# EAGLE design ble112_breakout_board_v22 (EAGLE 7.7.0)
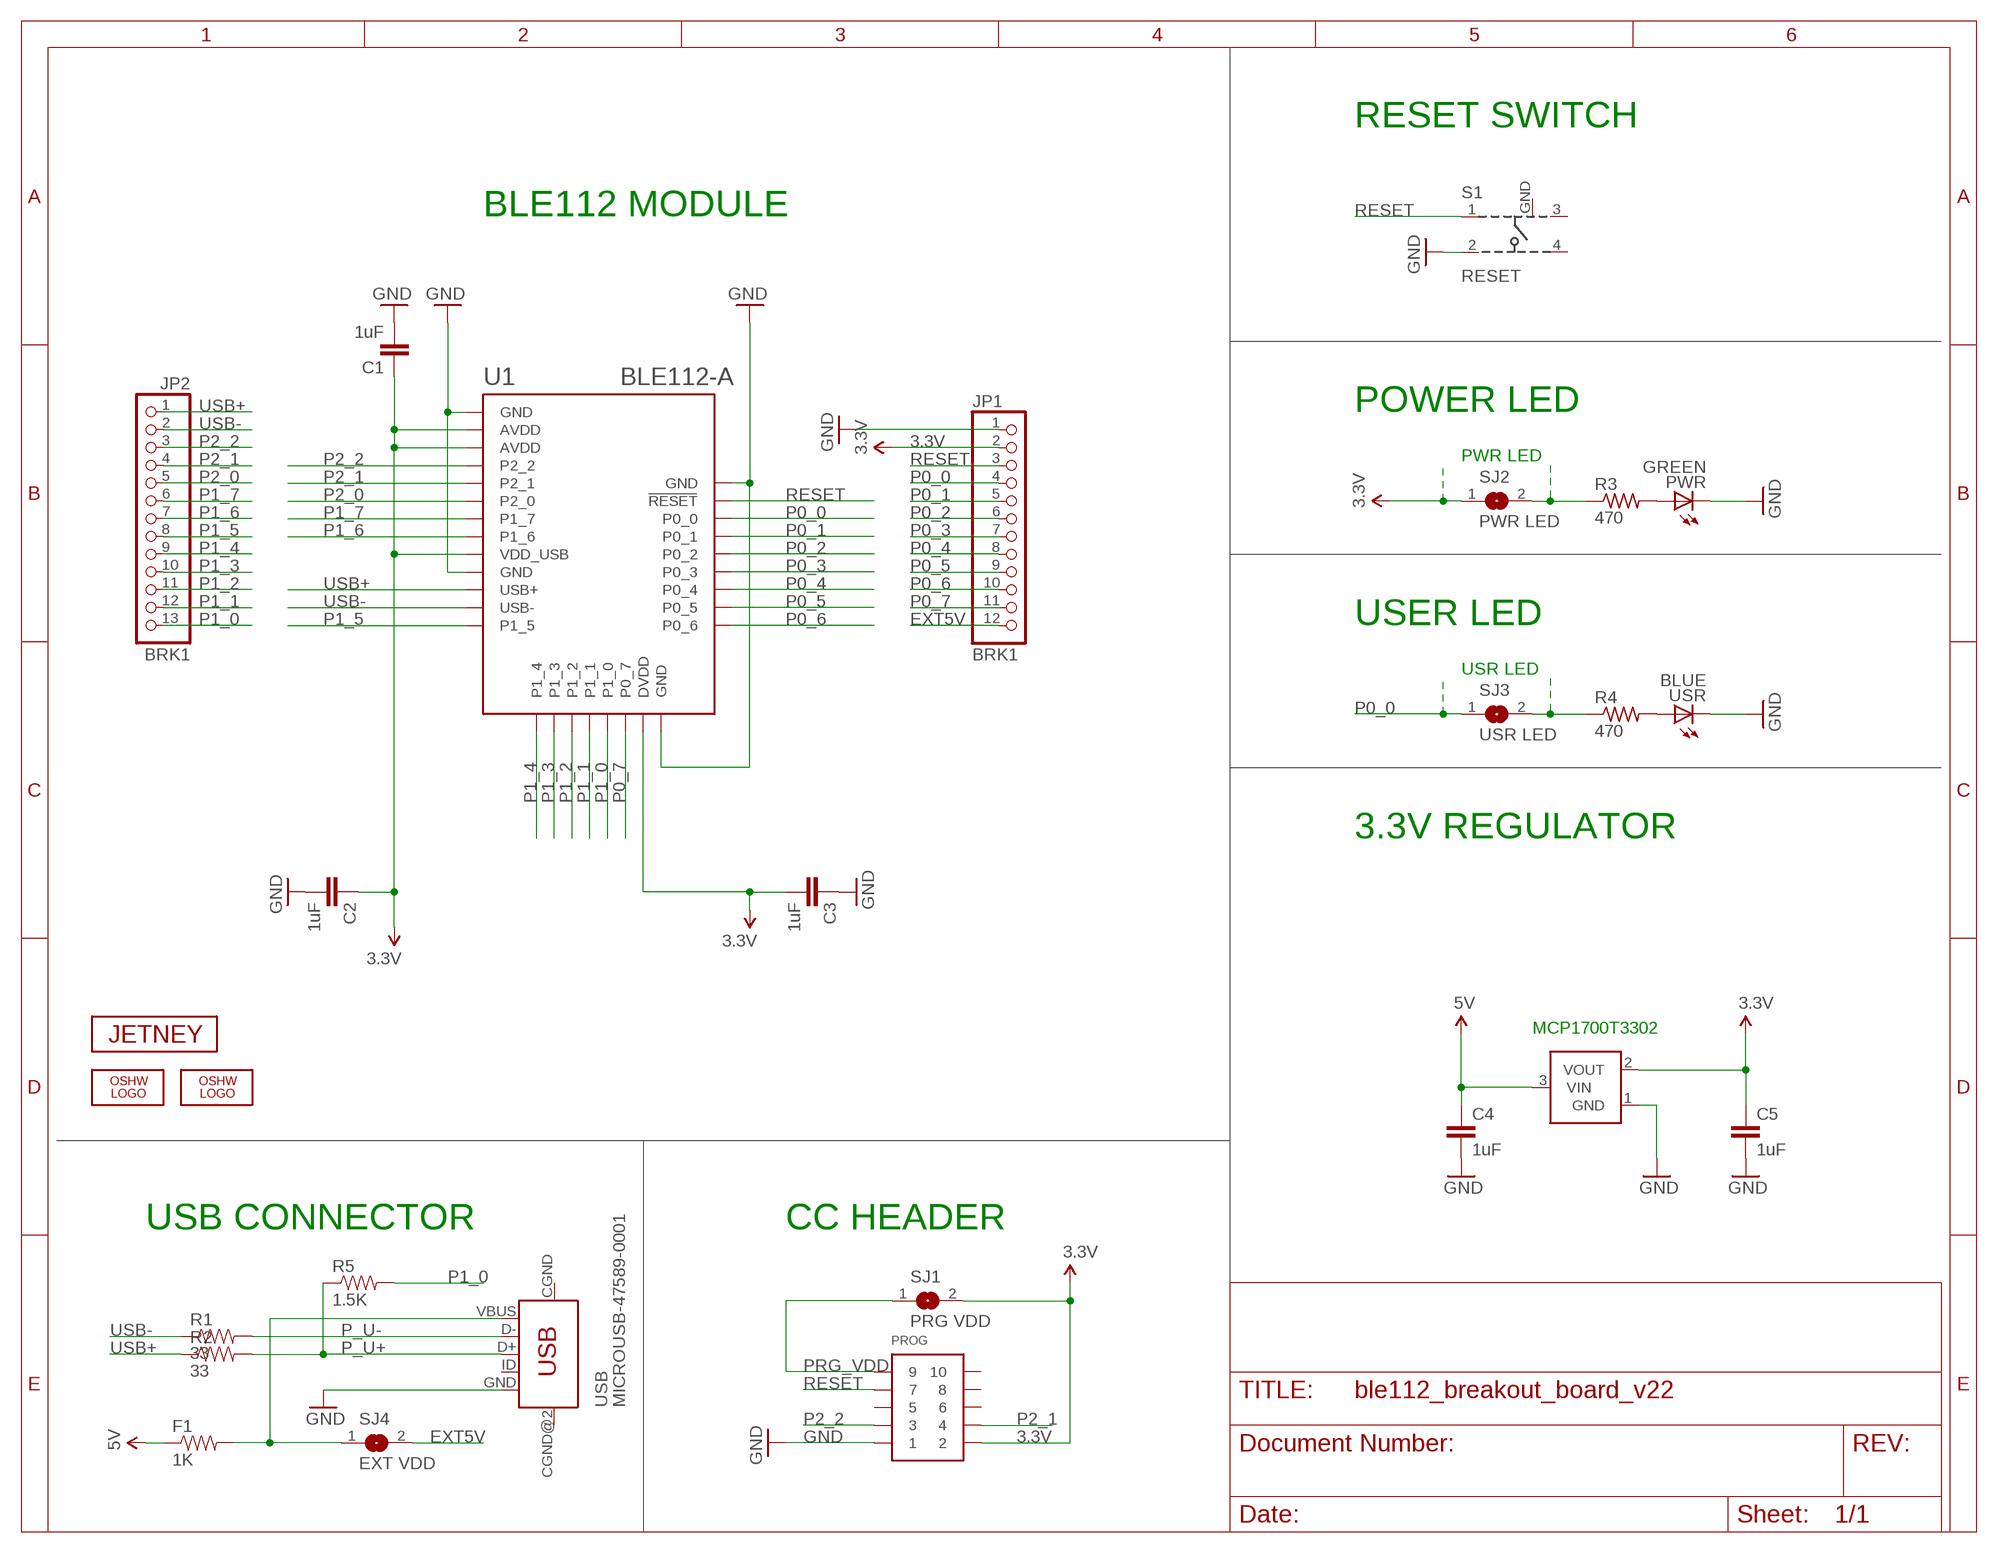
[diagram p0: schematic, sheet 1]

## Parts
C1  1uF  CAP0603-CAP  [0603-CAP]
C2  1uF  CAP0603-CAP  [0603-CAP]
C3  1uF  CAP0603-CAP  [0603-CAP]
C4  1uF  CAP0603-CAP  [0603-CAP]
C5  1uF  CAP0603-CAP  [0603-CAP]
F1  1K  RESISTOR0805-RES  [0805]
JP1  BRK1  PINHD-1X12  [1X12]
JP2  BRK1  PINHD-1X13  [1X13]
LOGO1  OSHW_LOGO_FILLX0100-NT  [OSHW_FILLX100_NOTEXT]
LOGO2  OSHW_LOGO_FILLX0100-NT  [OSHW_FILLX100_NOTEXT]
PROG  CONN_5-2-FTSH-V  [FTSH-105-DV]
PWR  GREEN  LEDCHIPLED_0805  [CHIPLED_0805]
R1  33  RESISTOR0603-RES  [0603-RES]
R2  33  RESISTOR0603-RES  [0603-RES]
R3  470  R-US_R0603  [R0603]
R4  470  R-US_R0603  [R0603]
R5  1.5K  RESISTOR0603-RES  [0603-RES]
S1  RESET  101-IG  [101-IG]
SJ1  PRG VDD  SJ  [SJ]
SJ2  PWR LED  SJ  [SJ]
SJ3  USR LED  SJ  [SJ]
SJ4  EXT VDD  SJ  [SJ]
U1  BLE112-A  BLE112-VISUAL-A  [BLE112-A]
U2  MCP1700  [SOT23-3]
U$3  JETNEY-LOGO-12  [JETNEY-LOGO-12]
USB  MICROUSB-47589-0001  [MICROUSB-47589-0001]
USR  BLUE  LEDCHIPLED_0805  [CHIPLED_0805]

## Nets
3.3V [power]: C1.1 C2.1 C3.2 C5.1 JP1.2 PROG.2 SJ1.2 SJ2.1 U1.AVDD U1.AVDD@2(AVDD) U1.DVDD U1.VDD_USB U2.2(VOUT)
5V [power]: C4.1 F1.1 U2.3(VIN)
EXT5V [power]: JP1.12 SJ4.2
GND [power]: C1.2 C2.2 C3.1 C4.2 C5.2 JP1.1 PROG.1 PWR.C S1.2 U1.GND U1.GND@2(GND) U1.GND@3(GND) U1.GND@4(GND) U2.1(GND) USB.GND USR.C
N$1: PWR.A R3.2
N$3 [power]: R3.1 SJ2.2
N$4: R4.2 USR.A
N$5: R4.1 SJ3.2
P0_0: JP1.4 SJ3.1 U1.P0_0
P0_1: JP1.5 U1.P0_1
P0_2: JP1.6 U1.P0_2
P0_3: JP1.7 U1.P0_3
P0_4: JP1.8 U1.P0_4
P0_5: JP1.9 U1.P0_5
P0_6: JP1.10 U1.P0_6
P0_7: JP1.11 U1.P0_7
P1_0: JP2.13 R5.2 U1.P1_0
P1_1: JP2.12 U1.P1_1
P1_2: JP2.11 U1.P1_2
P1_3: JP2.10 U1.P1_3
P1_4: JP2.9 U1.P1_4
P1_5: JP2.8 U1.P1_5
P1_6: JP2.7 U1.P1_6
P1_7: JP2.6 U1.P1_7
P2_0: JP2.5 U1.P2_0
P2_1: JP2.4 PROG.4 U1.P2_1
P2_2: JP2.3 PROG.3 U1.P2_2
P_U+: R2.2 R5.1 USB.D+
P_U-: R1.2 USB.D-
PRG_VDD [power]: PROG.9 SJ1.1
RESET: JP1.3 PROG.7 S1.1 U1.RESET
USB+: JP2.1 R2.1 U1.USB+
USB-: JP2.2 R1.1 U1.USB-
VBUS [power]: F1.2 SJ4.1 USB.VBUS
Unconnected: PROG.5 PROG.6 PROG.8 PROG.10 S1.3 S1.4 USB.CGND(MTN2) USB.CGND@2(MTN4) USB.ID

## Notes on the sheet
- RESET SWITCH
- BLE112 MODULE
- POWER LED
- PWR LED
- USER LED
- USR LED
- 3.3V REGULATOR
- MCP1700T3302
- USB CONNECTOR | CC HEADER

## Power pins joined to a net without a drawn wire
GND: S1.GND

## Library data of the parts
C1-C5 = SparkFun:CAP: Capacitor Standard 0603 ceramic capacitor, and 0.1" leaded capacitor.
F1 R1 R2 R5 = SparkFun:RESISTOR: Resistor Basic schematic elements and footprints for 0603, 1206, and PTH resistors.
JP1 = sf-pinhead:PINHD-1X12: PIN HEADER
JP2 = sf-pinhead:PINHD-1X13: PIN HEADER
LOGO1 LOGO2 = oshw-logo:OSHW_LOGO_FILL
PROG = pel_misc:CONN_5-2
PWR USR = led:LED: LED OSRAM: - CHIPLED LG R971, LG N971, LY N971, LG Q971, LY Q971, LO R971, LY R971 LH N974, LH R974 LS Q976, LO Q976, LY Q976 LO Q996 - Hyper CHIPLED LW Q18S LB Q993, LB Q99A, LB R99A - SideLED LS A670, LO A670, LY A670, LG A670, LP A670 LB A673, LV A673, LT A673, LW A673 LH A674 LY A675 LS A676, LA A676, LO A676, LY A676, LW A676 LS A679, LY A679, LG A679 - Hyper Micro SIDELED® LS Y876, LA Y876, LO Y876, LY Y876 LT Y87S - SmartLED LW L88C, LW L88S LB L89C, LB L89S, LG L890 LS L89K, LO L89K, LY L89K LS L896, LA L896, LO L896, LY L896 - TOPLED LS T670, LO T670, LY T670, LG T670, LP T670 LSG T670, LSP T670, LSY T670, LOP T670, LYG T670 LG T671, LOG T671, LSG T671 LB T673, LV T673, LT T673, LW T673 LH T674 LS T676, LA T676, LO T676, LY T676, LB T676, LH T676, LSB T676, LW T676 LB T67C, LV T67C, LT T67C, LS T67K, LO T67K, LY T67K, LW E67C LS E67B, LA E67B, LO E67B, LY E67B, LB E67C, LV E67C, LT E67C LW T67C LS T679, LY T679, LG T679 LS T770, LO T770, LY T770, LG T770, LP T770 LB T773, LV T773, LT T773, LW T773 LH T774 LS E675, LA E675, LY E675, LS T675 LS T776, LA T776, LO T776, LY T776, LB T776 LHGB T686 LT T68C, LB T68C - Hyper Mini TOPLED® LB M676 - Mini TOPLED Santana® LG M470 LS M47K, LO M47K, LY M47K Source: http://www.osram.convergy.de LUXEON: - LUMILED® LXK2-PW12-R00, LXK2-PW12-S00, LXK2-PW14-U00, LXK2-PW14-V00 LXK2-PM12-R00, LXK2-PM12-S00, LXK2-PM14-U00 LXK2-PE12-Q00, LXK2-PE12-R00, LXK2-PE12-S00, LXK2-PE14-T00, LXK2-PE14-U00 LXK2-PB12-K00, LXK2-PB12-L00, LXK2-PB12-M00, LXK2-PB14-N00, LXK2-PB14-P00, LXK2-PB14-Q00 LXK2-PR12-L00, LXK2-PR12-M00, LXK2-PR14-Q00, LXK2-PR14-R00 LXK2-PD12-Q00, LXK2-PD12-R00, LXK2-PD12-S00 LXK2-PH12-R00, LXK2-PH12-S00 LXK2-PL12-P00, LXK2-PL12-Q00, LXK2-PL12-R00 Source: www.luxeon.com KINGBRIGHT: KA-3528ASYC Source: www.kingbright.com
R3 R4 = resistor:R-US_: RESISTOR, American symbol
S1 = sf-keyglove:101-IG
SJ1-SJ4 = jumper:SJ: SMD solder JUMPER
U1 = sf-bluegiga:BLE112-VISUAL: Bluetooth Low Energy single-mode module - Bluetooth 4.0 (CC2540). BLE112-A variant has an on-module ceramic chip antenna, BLE112-E variant has U.Fl connector. BLE112-A variant includes keepout/restrict area. Antenna edge of the module should be flush up against the edge of the PCB. See datasheet for variant layout details. The BLE112 is a Bluetooth Smart module targeted for low-power sensors and accessories. It integrates all features required for a Bluetooth Smart application, including Bluetooth radio, software stack, and GATT-based profiles. The BLE112 Bluetooth Smart module can also host end-user applications, which means no external micro controller is required in size or price constrained devices. Morover, ithas flexible hardware interfaces to connect to different peripherals and sensors and can be powered directly from a standard 3V coin cell battery or a pair of AAA batteries. In the lowest power sleep mode it merely consumes 500 nA and will wake up within a few hundred microseconds. http://www.bluegiga.com/en-US/products/bluetooth-4.0-modules/ble112-bluetooth--smart-module https://github.com/jrowberg/sf-oshw Last updated 2014-01-04 by Jeff Rowberg <jeff@rowberg.net>; ANTENNA: On-module ceramic chip antenna
U2 = nonolith:MCP1700: Voltage regulator
U$3 = sf-keyglove:JETNEY-LOGO
USB = sf-keyglove:MICROUSB-47589-0001

## Net classes
0 default: width 0.152 mm, drill 0.33 mm, clearance 0.152 mm
1 power: width 0.254 mm, drill 0.33 mm, clearance 0.152 mm

## Board
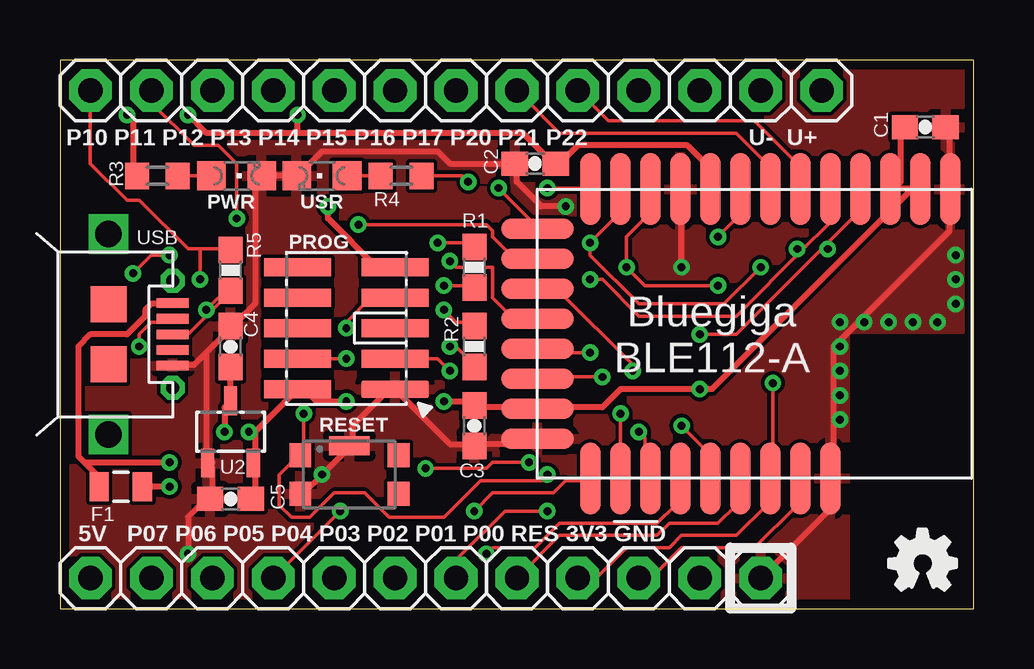
[diagram p1: board, top side]
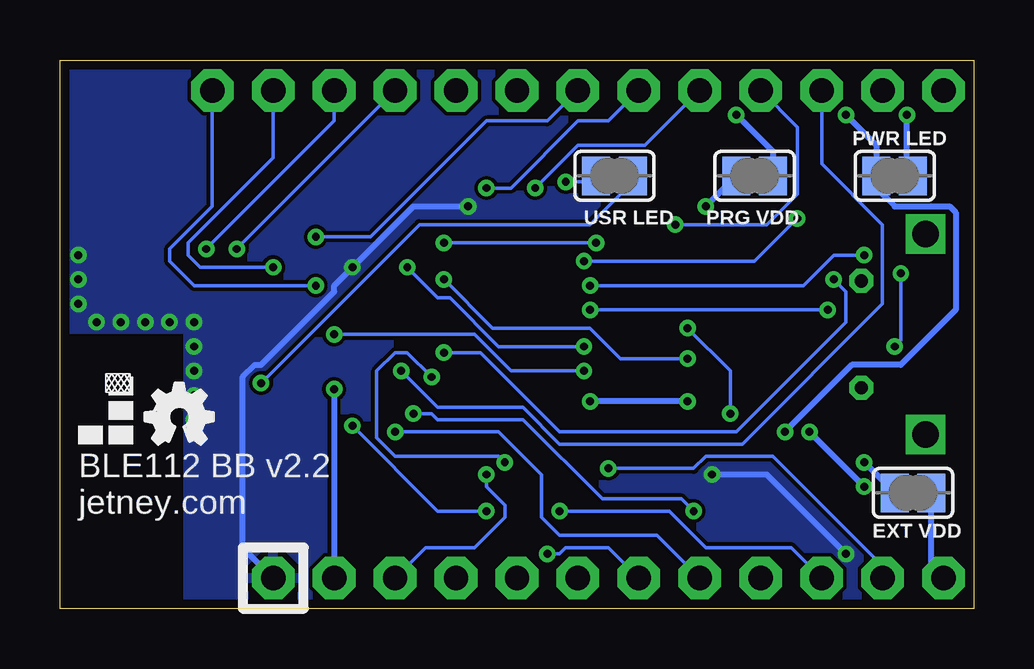
[diagram p2: board, bottom side, seen from below]

Size 38.1 x 22.86 mm. Coordinates in mm from the lower left corner, seen from the top.
Outline: 0,0 38.1,0 38.1,22.86 0,22.86 0,0
Copper layers (1*16): Top 0.0356mm / dielectric 1.5011mm / Bottom 0.0356mm
Design rules "default": minimum track width 6mil, minimum drill 13mil, track to track 6mil, track to pad 6mil, pad to pad 6mil, via to via 6mil, smd to smd 6mil, copper to edge 15mil, drill to drill 6mil, minimum pad ring 7mil, minimum via ring 7mil, stop-mask expansion 4mil, vias tented up to drill 13mil, thermal gap 10mil
tKeepout: area 33,0 to 38,5.6
bKeepout: area 33,0 to 38,5.6
tRestrict: area 33,0 to 38,5.6
bRestrict: area 33,0 to 38,5.6
vRestrict: area 0.3,19.3 to 32.8,20.1; area 0.5,2.8 to 30.5,3.6; area 33,0 to 38,5.6

### Footprints (pad centres in the part's own frame; a part is rotated, then mirrored left to right if it is on the bottom)
0603-CAP = smd 1.1 x 1: 1 -0.85,0; 2 0.85,0
0805 = smd 0.8 x 1.2: 1 -0.9,0; 2 0.9,0
1X12 = drill 1.016 pad 1.778 octagon: 1 -13.97,0; 2 -11.43,0; 3 -8.89,0; 4 -6.35,0; 5 -3.81,0; 6 -1.27,0; 7 1.27,0; 8 3.81,0; 9 6.35,0; 10 8.89,0; 11 11.43,0; 12 13.97,0
1X13 = drill 1.016 pad 1.778 octagon: 1 -15.24,0; 2 -12.7,0; 3 -10.16,0; 4 -7.62,0; 5 -5.08,0; 6 -2.54,0; 7 0,0; 8 2.54,0; 9 5.08,0; 10 7.62,0; 11 10.16,0; 12 12.7,0; 13 15.24,0
FTSH-105-DV = smd 0.74 x 2.8: 1 -2.54,-2.03; 2 -2.54,2.03; 3 -1.27,-2.03; 4 -1.27,2.03; 5 0,-2.03; 6 0,2.03; 7 1.27,-2.03; 8 1.27,2.03; 9 2.54,-2.03; 10 2.54,2.03
CHIPLED_0805 = smd 1.2 x 1.2: A 0,-1.05; C 0,1.05
0603-RES = smd 1.1 x 1: 1 -0.85,0; 2 0.85,0
R0603 = smd 1 x 1.1: 1 -0.85,0; 2 0.85,0
101-IG = smd 0.9 x 1: 1 -2.05,0.8; 2 -2.05,-0.8; 3 2.05,0.8; 4 2.05,-0.8 | smd 1.7 x 0.8: GND 0,1.2
SJ = smd 1.168 x 1.6: 1 -0.762,0; 2 0.762,0
BLE112-A = smd 3 x 0.85: AVDD -6.05,6.9; AVDD@2 -6.05,5.65; GND -6.05,8.15; GND@2 -6.05,-3.1; GND@4 6,3.15; P0_0 6,0.65; P0_1 6,-0.6; P0_2 6,-1.85; P0_3 6,-3.1; P0_4 6,-4.35; P0_5 6,-5.6; P0_6 6,-6.85; P1_5 -6.05,-6.85; P1_6 -6.05,-0.6; P1_7 -6.05,0.65; P2_0 -6.05,1.9; P2_1 -6.05,3.15; P2_2 -6.05,4.4; RESET 6,1.9; USB+ -6.05,-4.35; USB- -6.05,-5.6; VDD_USB -6.05,-1.85 | smd 0.85 x 3: DVDD 3.1,-9.05; GND@3 4.35,-9.05; P0_7 1.85,-9.05; P1_0 0.6,-9.05; P1_1 -0.65,-9.05; P1_2 -1.9,-9.05; P1_3 -3.15,-9.05; P1_4 -4.4,-9.05
SOT23-3 = smd 0.55 x 1.2: 1 0.95,1.3; 2 -0.95,1.3; 3 0,-1.3
MICROUSB-47589-0001 = drill 0.55 pad 1 octagon: CGND 0,2.225; CGND@2 0,-2.225 | drill 1.1 pad 1.6 square: CGND@3 -2.675,-4.175; CGND@4 -2.675,4.175 | smd 1.5 x 1.5: CGND@5 -2.675,1.25; CGND@6 -2.675,-1.25 | smd 1.35 x 0.4: D+ 0,0; D- 0,0.65; GND 0,-1.3; ID 0,-0.65; VBUS 0,1.3

### Placement (x,y rotation side)
C1  36.07,20.07 0 top
C2  19.81,18.54 180 top
C3  17.27,7.62 90 top
C4  7.11,10.92 90 top
C5  7.11,4.57 180 top
F1  2.54,5.08 180 top
JP1  15.24,1.27 180 top
JP2  16.51,21.59 180 top
LOGO1  34.54,0.76 0 top
LOGO2  34.54,6.86 0 bottom
PROG  11.94,11.68 90 top
PWR  7.37,18.03 270 top
R1  17.27,14.22 270 top
R2  17.27,10.92 90 top
R3  4.06,18.03 0 top
R4  14.22,18.03 180 top
R5  7.11,14.1 90 top
S1  12.06,5.59 0 top
SJ1  9.14,18.03 0 bottom
SJ2  3.3,18.03 0 bottom
SJ3  14.99,18.03 180 bottom
SJ4  2.54,4.83 0 bottom
U1  28.96,11.43 270 top
U2  7.11,7.37 180 top
U$3  37.34,6.86 0 bottom
USB  4.7,11.43 0 top
USR  10.92,18.03 90 top

### Tracks (layer width: path | path; a pad name or v marks a point on that pad's centre or on a via)
3.3V  (via drill 0.33)
  Top 0.254: 34.8,17.53 35.05,17.78 35.05,20.07 C1.1 | 34.8,17.53 35.56,17.53 | 35.56,17.53 35.81,17.53 U1.AVDD 35.56,17.53 | 34.8,17.53 U1.AVDD@2 | 35.56,17.53 27.18,9.14 v26.67,9.14 23.37,9.14 22.61,8.38 20.07,8.38 U1.DVDD 19.81,8.38 17.27,8.38 C3.2 17.27,8.64 v16,8.64 | C5.1 8.13,4.57 8.13,5.84 U2.2 8.13,6.1 8.13,7.37 | 8.13,7.37 PROG.2 10.16,9.14 10.67,8.64 v11.94,8.64 | U1.VDD_USB 26.92,17.53 26.92,18.54 26.16,19.3 21.59,19.3 20.83,18.54 C2.1 20.57,18.54 19.3,19.81 9.91,19.81 | v5.33,20.57 6.1,19.81 9.91,19.81 | 9.91,19.81 v9.91,20.57 | v7.87,7.37 8.13,7.37
  Bottom 0.254: v26.67,9.14 JP1.2 | v5.33,20.57 4.06,19.3 SJ2.1 4.06,17.53 3.3,16.76 1.02,16.76 0.76,16.51 0.76,12.45 3.05,10.16 5.08,10.16 v7.87,7.37 | SJ1.2 8.38,19.05 v9.91,20.57 | v11.94,8.64 v16,8.64
5V  (via drill 0.33)
  Top 0.254: C4.1 U2.3 7.11,8.64 6.86,8.38 v6.86,7.37 | v4.57,5.08 F1.1
  Bottom 0.254: v6.86,7.37 v4.57,5.08
EXT5V
  Bottom 0.254: SJ4.2 1.78,1.78 JP1.12
GND  (via drill 0.33)
  Top 0.254: 17.27,6.86 19.81,6.86 U1.GND@3 20.07,7.11 | S1.2 10.16,4.83 v10.92,5.59 11.94,6.6 S1.GND 12.19,6.86 12.19,7.62 13.72,9.14 PROG.1 16.26,6.86 17.27,6.86 | 17.27,6.86 C3.1 | U2.1 6.35,5.84 6.35,4.57 C5.2 6.1,4.57 5.33,3.81 v5.33,2.29 | 6.35,6.1 U2.1 | 6.1,10.67 5.59,10.16 4.83,10.16 USB.GND | 6.1,10.67 7.11,11.68 C4.2 7.11,11.94 7.37,11.94 8.13,12.7 8.13,17.78 8.38,18.03 PWR.C USR.C 9.91,18.03 10.92,19.05 15.75,19.05 16.26,18.54 C2.2 19.05,18.54 19.05,17.78 20.07,16.76 v21.08,16.76 | 6.1,10.67 6.1,6.1 U2.1 | C1.2 37.08,20.07 37.08,17.53 U1.GND 37.08,17.27 37.08,15.75 32.26,10.92 32.26,5.59 U1.GND@4 32,5.33 32,4.06 JP1.1 | 25.91,17.53 U1.GND@2 25.91,17.27 v25.91,14.22
  Bottom 0.254: v10.92,5.59 8.64,5.59 v5.33,2.29 | JP1.1 30.48,2.54 30.48,9.65 29.97,10.16 29.72,10.16 26.67,13.21 26.67,13.46 v25.91,14.22 23.37,16.76 v21.08,16.76
  other vias: 32.51,11.94 33.53,11.94 34.54,11.94 35.56,11.94 36.58,11.94 37.34,12.7 37.34,13.72 37.34,14.73 32.51,10.92 32.51,9.91 32.51,8.89 32.51,7.87
  pour Top: 0.25,22.61 37.85,22.61 37.85,0.25 0.25,0.25
  pour Bottom: 0.25,22.61 37.85,22.61 37.85,0.25 0.25,0.25
N$1
  Top 0.152: PWR.A R3.2
N$3  (via drill 0.33)
  Top 0.254: v2.79,20.57 3.05,20.32 3.05,18.03 R3.1
  Bottom 0.254: v2.79,20.57 2.79,18.29 SJ2.2
N$4
  Top 0.152: USR.A R4.2
N$5  (via drill 0.33)
  Top 0.152: R4.1 16.76,18.03 v17.02,17.78
  Bottom 0.152: v17.02,17.78 16,17.78 SJ3.2
N$6
  Bottom 0.152: 2.79,18.03 3.81,18.03
N$8
  Bottom 0.152: 14.48,18.03 15.49,18.03
N$9
  Bottom 0.152: 8.64,18.03 9.65,18.03
N$10
  Bottom 0.152: 2.03,4.83 3.05,4.83
P0_0  (via drill 0.33)
  Top 0.152: v29.72,9.4 29.72,5.59 U1.P0_0 29.46,5.33 29.46,4.32 28.19,3.05 25.91,3.05 25.4,2.54 23.62,2.54 22.35,1.27 JP1.4
  Bottom 0.152: SJ3.1 14.73,17.53 14.73,17.27 16,16 23.11,16 v29.72,9.4
P0_1
  Top 0.152: JP1.5 20.83,3.05 24.89,3.05 25.4,3.56 27.43,3.56 28.19,4.32 28.19,5.33 U1.P0_1
P0_2  (via drill 0.33)
  Top 0.152: v25.91,7.62 26.92,6.6 26.92,5.59 U1.P0_2 | v20.32,4.06 18.54,4.06 16.51,2.03 JP1.6
  Bottom 0.152: v25.91,7.62 22.35,4.06 v20.32,4.06
P0_3  (via drill 0.33)
  Top 0.152: v17.78,2.29 18.03,2.54 19.81,2.54 20.83,3.56 24.89,3.56 25.65,4.32 25.65,5.33 U1.P0_3
  Bottom 0.152: v17.78,2.29 17.27,2.29 17.02,2.54 15.24,2.54 JP1.7
P0_4  (via drill 0.33)
  Top 0.152: v24.13,7.37 24.38,7.11 24.38,5.59 U1.P0_4
  Bottom 0.152: v24.13,7.37 19.81,7.37 18.03,5.59 18.03,3.81 17.27,3.05 13.21,3.05 JP1.8
P0_5  (via drill 0.33)
  Top 0.152: v23.37,8.13 23.37,5.59 U1.P0_5 | JP1.9 v11.68,4.06
  Bottom 0.152: v23.37,8.13 22.61,8.13 22.35,7.87 18.8,7.87 15.49,4.57 12.19,4.57 v11.68,4.06
P0_6  (via drill 0.33)
  Top 0.152: v17.27,4.06 18.03,4.83 20.57,4.83 21.08,5.33 22.1,5.33 U1.P0_6
  Bottom 0.152: v17.27,4.06 12.7,4.06 11.18,2.54 7.62,2.54 JP1.10
P0_7  (via drill 0.33)
  Top 0.152: v22.61,9.65 20.07,9.65 U1.P0_7 | v19.56,6.1 18.03,6.1 17.78,5.84 v15.24,5.84
  Bottom 0.152: v22.61,9.65 23.62,10.67 24.13,10.67 24.89,9.91 24.89,7.11 24.13,6.35 19.81,6.35 v19.56,6.1 | v15.24,5.84 11.68,5.84 11.18,6.35 8.38,6.35 3.81,1.78 JP1.11
P1_0  (via drill 0.33)
  Top 0.152: 5.84,14.99 5.33,14.99 3.3,17.02 2.79,17.02 1.27,18.54 JP2.13 | 5.84,14.99 7.11,14.99 R5.2 | v22.1,10.67 20.07,10.67 U1.P1_0 | 5.84,14.99 v5.84,13.72
  Bottom 0.152: v22.1,10.67 20.57,10.67 17.27,7.37 9.91,7.37 5.33,11.94 5.33,13.21 v5.84,13.72
P1_1  (via drill 0.33)
  Top 0.152: v16.26,14.48 16.51,14.22 18.03,14.22 18.03,12.95 18.8,12.19 19.81,12.19 U1.P1_1 | v7.37,16.26 7.37,18.54 6.6,19.3 5.59,19.3 3.81,21.08 JP2.12
  Bottom 0.152: v16.26,14.48 9.14,14.48 v7.37,16.26
P1_2  (via drill 0.33)
  Top 0.152: v23.88,9.91 23.88,10.16 20.83,13.21 20.07,13.21 U1.P1_2
  Bottom 0.152: v23.88,9.91 22.35,8.38 18.8,8.38 17.27,6.86 9.65,6.86 3.81,12.7 3.81,16 6.35,18.54 JP2.11
P1_3  (via drill 0.33)
  Top 0.152: v12.45,16 17.78,16 18.03,15.75 18.03,15.49 18.8,14.73 19.81,14.73 U1.P1_3
  Bottom 0.152: v12.45,16 8.64,16 7.37,17.27 7.37,20.07 JP2.10
P1_4  (via drill 0.33)
  Top 0.152: v18.29,17.53 19.81,16 U1.P1_4
  Bottom 0.152: v18.29,17.53 16.51,19.3 13.72,19.3 JP2.9
P1_5  (via drill 0.33)
  Top 0.152: v20.32,17.53 22.1,17.53 U1.P1_5
  Bottom 0.152: v20.32,17.53 19.3,17.53 16.51,20.32 15.24,20.32 JP2.8
P1_6  (via drill 0.33)
  Top 0.152: v27.43,15.49 28.19,16.26 28.19,17.27 U1.P1_6
  Bottom 0.152: v27.43,15.49 25.15,15.49 20.32,20.32 17.78,20.32 JP2.7
P1_7
  Top 0.152: JP2.6 20.83,19.81 28.19,19.81 29.46,18.54 29.46,17.53 U1.P1_7
P2_0
  Top 0.152: JP2.5 22.86,20.32 28.96,20.32 30.73,18.54 30.73,17.53 U1.P2_0
P2_1  (via drill 0.33)
  Top 0.152: v11.94,10.41 PROG.4 | v22.1,13.72 22.61,13.72 24.13,12.19 28.19,12.19 30.99,14.99 | 30.99,14.99 32,16 32,17.27 U1.P2_1 | 30.99,14.99 v30.73,14.99
  Bottom 0.152: v11.94,10.41 14.73,10.41 16,11.68 20.07,11.68 v22.1,13.72 | v30.73,14.99 JP2.4
P2_2  (via drill 0.33)
  Top 0.152: PROG.3 15.75,10.41 v16.26,9.91 | v26.67,11.43 28.19,11.43 31.75,14.99 | 31.75,14.99 33.27,16.51 33.27,17.27 U1.P2_2 | 31.75,14.99 v32,14.99
  Bottom 0.152: v16.26,9.91 19.3,9.91 20.83,11.43 v26.67,11.43 | JP2.3 26.67,20.32 v32,14.99
P_U+  (via drill 0.33)
  Top 0.152: v16,12.45 16.51,11.94 17.27,11.94 R2.2 | v6.1,12.45 7.11,13.46 R5.1 7.11,13.21 5.33,11.43 USB.D+
  Bottom 0.152: v6.1,12.45 v16,12.45
P_U-  (via drill 0.33)
  Top 0.152: v16,13.46 17.27,13.46 R1.2 | v4.57,14.73 3.81,14.73 v3.05,13.97 | v3.3,10.92 3.3,11.43 3.81,11.94 4.57,11.94 USB.D-
  Bottom 0.152: v16,13.46 7.11,13.46 5.84,14.73 v4.57,14.73 | v3.05,13.97 3.05,11.18 v3.3,10.92
PRG_VDD  (via drill 0.33)
  Top 0.254: v11.18,16.76 11.18,16.26 13.21,14.22 PROG.9
  Bottom 0.254: v11.18,16.76 SJ1.1
RESET  (via drill 0.33)
  Top 0.152: v10.16,8.13 10.16,6.6 S1.1 9.91,6.35 9.14,5.59 9.14,4.32 9.65,3.81 10.41,3.81 11.43,4.83 12.7,4.83 13.72,3.81 16,3.81 17.53,5.33 20.07,5.33 v20.32,5.59 | v11.94,11.68 11.94,11.94 12.95,12.95 PROG.7 | JP1.3 24.64,1.27 25.91,2.54 28.96,2.54 30.73,4.32 30.73,5.33 U1.RESET
  Bottom 0.152: v10.16,8.13 10.16,9.91 v11.94,11.68 | v20.32,5.59 20.32,5.08 19.56,4.32 19.56,3.81 20.83,2.54 22.86,2.54 JP1.3
USB+  (via drill 0.33)
  Top 0.152: v16.26,10.92 16.51,10.92 17.27,10.16 R2.1 | U1.USB+ 24.38,17.27 24.38,16.26 23.62,15.49 v23.62,14.22 24.38,13.46 v27.43,13.46
  Bottom 0.152: v16.26,10.92 19.81,10.92 21.84,12.95 22.35,12.95 v23.62,14.22 | JP2.1 31.75,16.76 33.53,14.99 33.53,14.48 32.51,13.46 v27.43,13.46
USB-  (via drill 0.33)
  Top 0.152: v15.75,15.24 17.27,15.24 R1.1 | U1.USB- 23.11,17.27 23.11,16.26 v22.1,15.24 22.1,14.73 24.13,12.7 27.69,12.7 v29.21,14.22
  Bottom 0.152: v22.1,15.24 v15.75,15.24 | JP2.2 29.21,18.8 32.77,15.24 32.77,14.73 32.26,14.22 v29.21,14.22
VBUS  (via drill 0.33)
  Top 0.254: 1.02,6.1 0.76,6.35 0.76,10.92 1.27,11.43 2.79,11.43 3.56,12.19 3.56,12.45 3.81,12.7 4.57,12.7 USB.VBUS | 1.02,6.1 1.52,5.59 1.52,5.08 F1.2 | 1.02,6.1 v4.57,6.1
  Bottom 0.254: v4.57,6.1 SJ4.1

### Text on the board
tPlace: P10 P11 P12 P13 P14 P15 P16 P17 P20 P21 P22 | U- U+ | Bluegiga / BLE112-A | RESET | 5V | P07 P06 P05 P04 P03 P02 P01 P00 RES 3V3 GND
bPlace: PWR LED | PRG VDD | USR LED | BLE112 BB v2.2 | EXT VDD | jetney.com